# Altium schematic sheet AMU-S02-V00-PSU3V3.SchDoc: Power Supply (20-40V to 3v3 @ 0.1-0.6A)
size A3; DrawnBy: Jonn Dillon; DocumentNumber: 2; Revision: 01; SheetNumber: 2; SheetTotal: 12; Version: 01; Project: AMU 2020 (Sourced from BMS 2020); PageSetup: Record=PageOptions|CenterHorizontal=True|CenterVertical=True|PrintScale=0.97|XCorrection=1.00|YCorrection=1.00|PrintKind=0|BorderSize=5000000|LeftOffset=0|BottomOffset=0|Orientation=2|PaperLength=1000|PaperWidth=1000|Scale=100|PaperSource=7|PrintQuality=-4|MediaType=1|DitherType=10|PaperKind=A4|PrintScaleMode=1
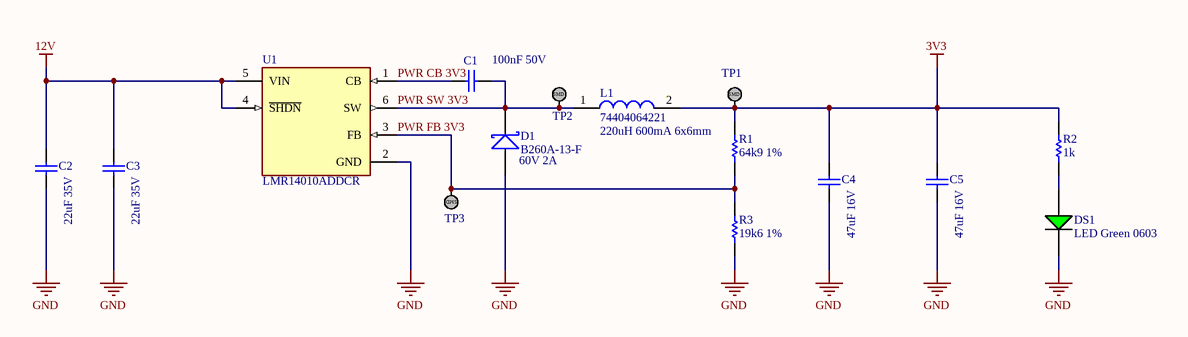
[diagram p0: AMU-S02-V00-PSU3V3.SchDoc]

## Parts
C1  100nF 50V  [Cap_Ceramic_0603]
C2  22uF 35V  [Cap_Ceramic_1206]
C3  22uF 35V  [Cap_Ceramic_1206]
C4  47uF 16V  [Cap_Ceramic_0603]
C5  47uF 16V  [Cap_Ceramic_0603]
D1  B260A-13-F  [SMA]
DS1  LED Green 0603  [LED GREEN 0603]
L1  74404064221  [Inductor_6x6mm]
R1  64k9 1%  [Res_ThinFilm_0603]
R2  1k  [Res_ThinFilm_0603]
R3  19k6 1%  [Res_ThinFilm_0603]
TP1  TestPoint_SMD  [TestPointSMD]  (value not drawn)
TP2  TestPoint_SMD  [TestPointSMD]  (value not drawn)
TP3  TestPoint_SMD  [TestPointSMD]  (value not drawn)
U1  LMR14010ADDCR  [FP-DDC0006A-MFG]

## Nets
3V3: C4.2 C5.2 L1.2 R1.2 R2.2 TP1.1
12V: C2.2 C3.2 U1.4(~{SHDN}) U1.5(VIN)
GND: C2.1 C3.1 C4.1 C5.1 D1.A DS1.2(C) R3.1 U1.2(GND)
PWR CB 3V3: C1.1 U1.1(CB)
PWR FB 3V3: R1.1 R3.2 TP3.1 U1.3(FB)
PWR SW 3V3: C1.2 D1.K L1.1 TP2.1 U1.6(SW)
NetDS1_1: DS1.1(A) R2.1

## Notes on the sheet
- (near D1) 60V 2A
- (near L1) 220uH 600mA 6x6mm
- Revision History:
- Sheet Title:
- Rev
- Date
- Description
- Project:
- Size:
- Drawn By:
- A3
- Number:
- Revision:
- Sheet
- Version:
- of
- QUT Motorsport
- O-120, Gardens Point
- 2 George Street
- Brisbane, QLD 4000
- Australia
- Print Date:
- Print Time:
- File Name:
- (in symbol TestPoint_SMD) SMD

## Library data of the parts
C1 = 100nF 50V 5% X7R 0603: Capacitor, Ceramic, SMD, 100nF, 50V, 5%, X7R, 0603
C2 C3 = 22uF 35V 20% X5R 1206: 22µF ±20% 35V Ceramic Capacitor X5R 1206 (3216 Metric); ComponentLink1Description: Digikey; ComponentLink1URL: https://www.digikey.com.au/product-detail/en/tdk-corporation/C3216X5R1V226M160AC/445-8045-1-ND/2792165; ComponentLink2Description: Datasheet; ComponentLink2URL: https://product.tdk.com/info/en/catalog/datasheets/mlcc_commercial_general_en.pdf
C4 C5 = 47uF 16V 10% X7R 1210: Capacitor, Ceramic, SMD, 47uF, 16V, 5%, X7R, 1210
D1 = B260A-13-F: Diode, Schottky Barrier Rectifier, 60 V, 2 A, B260A-13-F
L1 = 74404064221: FIXED IND 220UH 660MA 850 MOHM; ComponentLink1Description: Digikey; ComponentLink1URL: https://www.digikey.com.au/product-detail/en/w%C3%BCrth-elektronik/74404064221/732-7261-1-ND/5353241; ComponentLink2Description: LCSC A; ComponentLink2URL: https://lcsc.com/product-detail/Power-Inductors_Sunlord-SWPA6045S221MT_C91047.html; ComponentLink3Description: LCSC B; ComponentLink3URL: https://lcsc.com/product-detail/Power-Inductors_SXN-Shun-Xiang-Nuo-Elec-SMNR6045-221MT_C467145.html
R1 = 64k9 1% 0603: Resistor, SMD, 64k9, 0.1W, 5%, 0603
R2 = 1k 5% 0603: Resistor, SMD, 1k, 0.1W, 5%, 0603
R3 = 19k6 1% 0603: Resistor, SMD, 19k6, 0.1W, 5%, 0603
U1 = CMP-04918-000056-1: IC REG BUCK ADJ 1A TSOT23-6; Manufacturer: Texas Instruments; Max Junction Temp: +125°C; Number Of Outputs: 1; Standoff Height: 0mm; Switching Frequency: 700kHz; Min Supply Voltage: 4V; Max Supply Voltage: 40V; Max Duty Cycle: 96%; Output Type: AdjustableProgrammable; Manufacturer Part Number: LMR14010ADDCR; Temperature: -40°C to +125°C; Output Current: 1A; Category: IC; Temperature Range High: +125°C; Lead Free: Yes; Switching Topology: Buck; Mouser Description: 4-V to 40-V, 1-A Step-Down Converter With High Efficiency Eco-Mode 6-SOT-23-THIN -40 to 125; Device Class L1: Integrated Circuits (ICs); Digikey Description: IC REG BUCK ADJ 1A TSOT23-6; Package: DDC0006A; Ipc Land Pattern Name: SOT95P280X110-6; Device Class L2: Power Management ICs; Temperature Range Low: -40°C; Height: 1.1mm; Device Class L3: Voltage Regulators - Switching; RoHS: TRUE; Automotive: No; Octopart: https://octopart.com/lmr14010addcr-texas+instruments-90753290; ComponentLink2URL: https://www.ti.com/lit/ds/symlink/lmr14010a.pdf; ComponentLink2Description: Datasheet